# Altium schematic sheet ethernet.SchDoc
size 420 x 297 mm
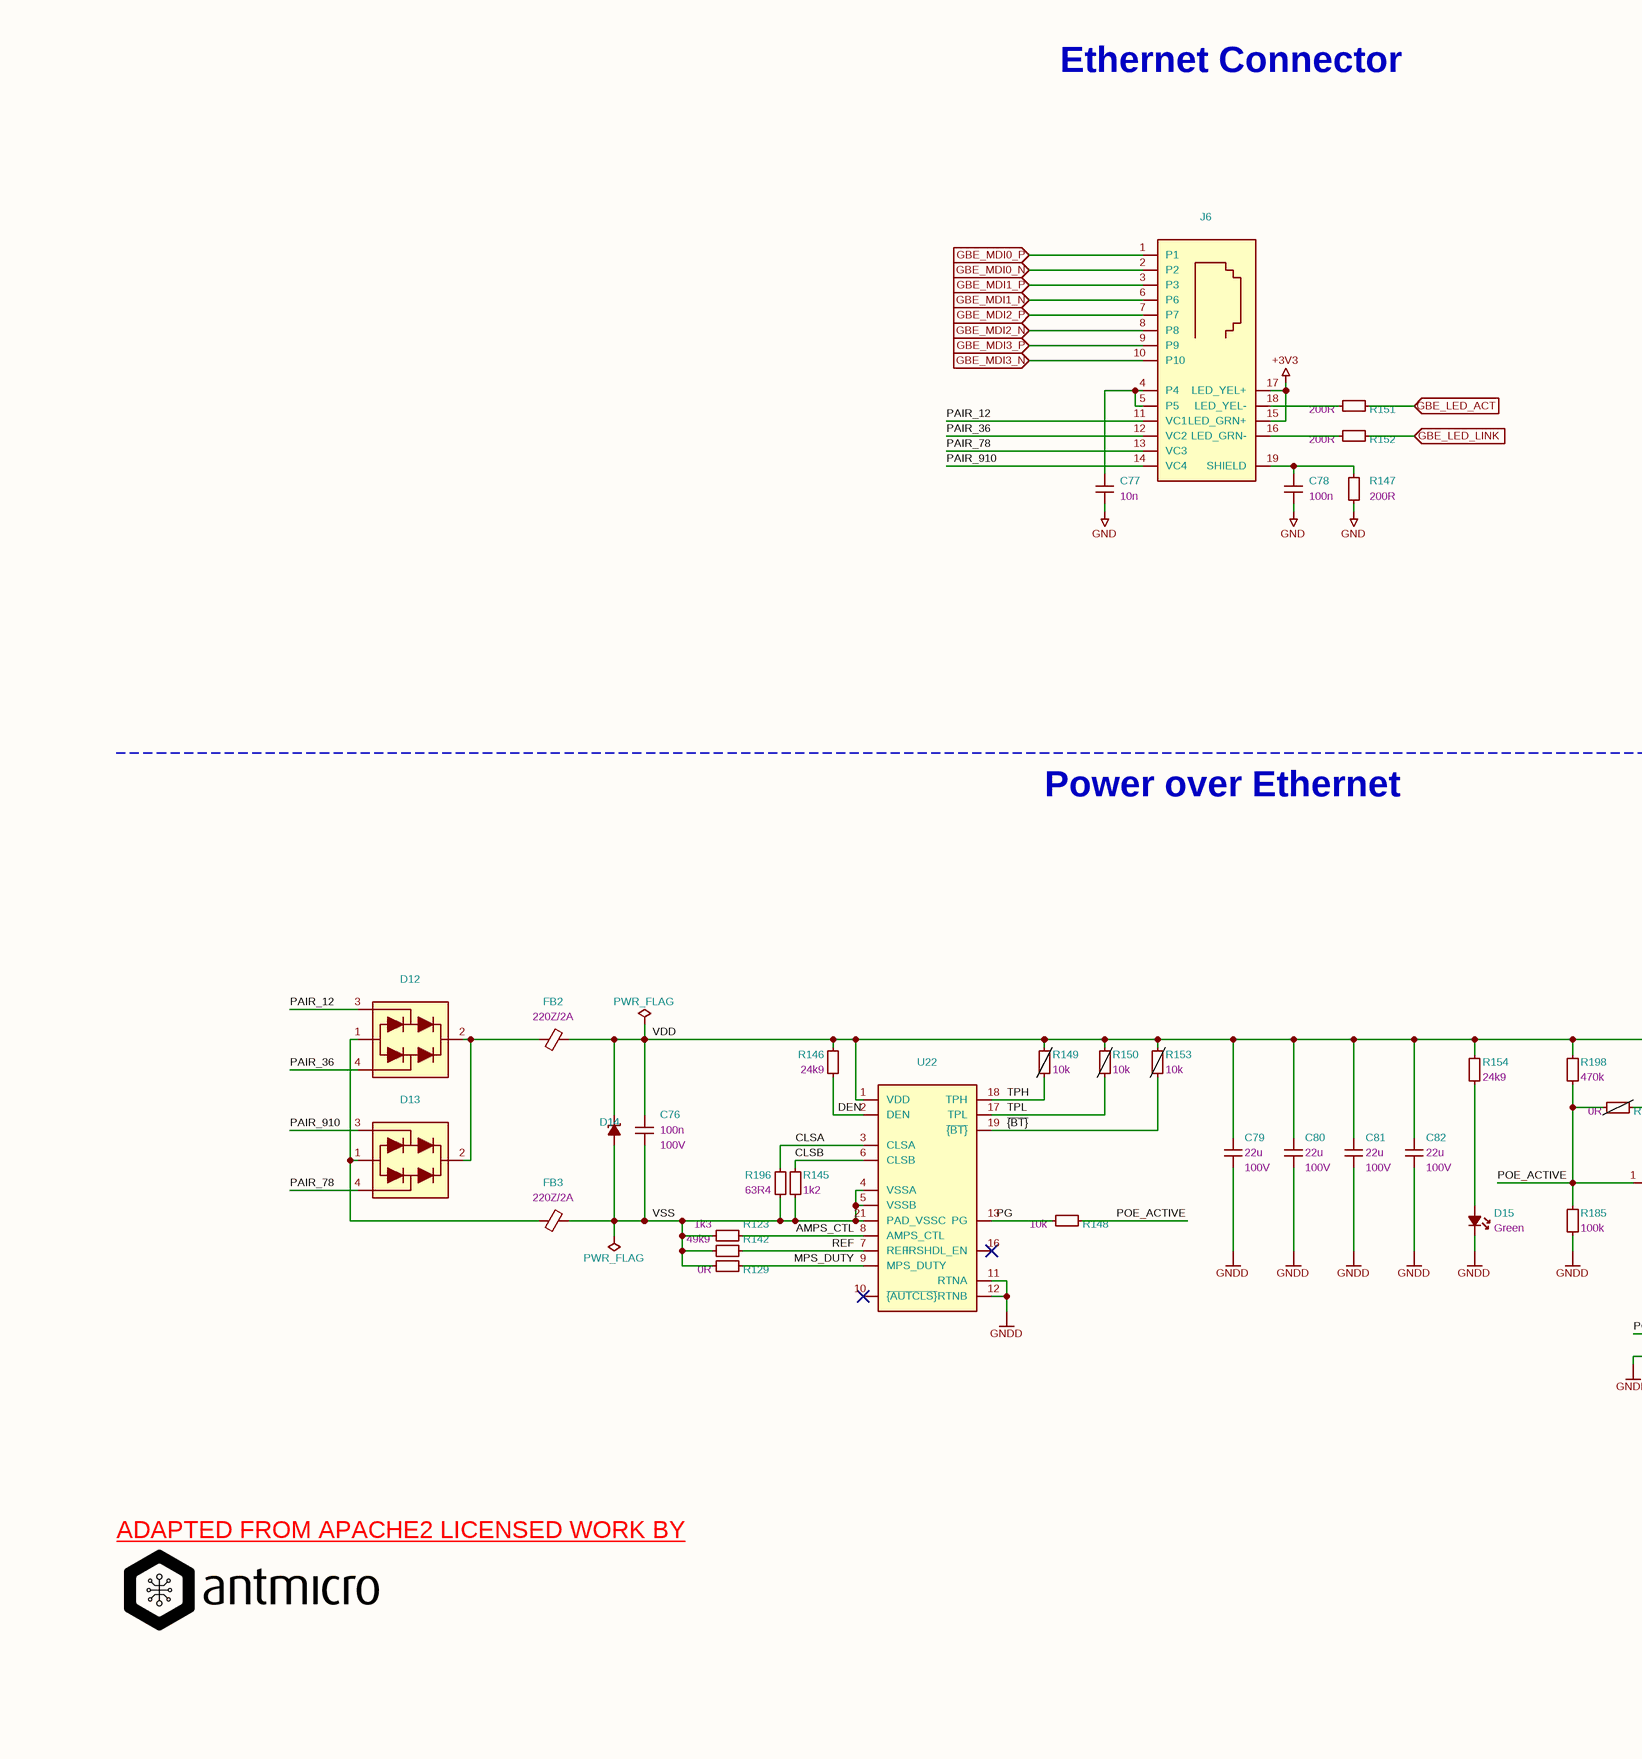
[diagram p0: ethernet.SchDoc, left]
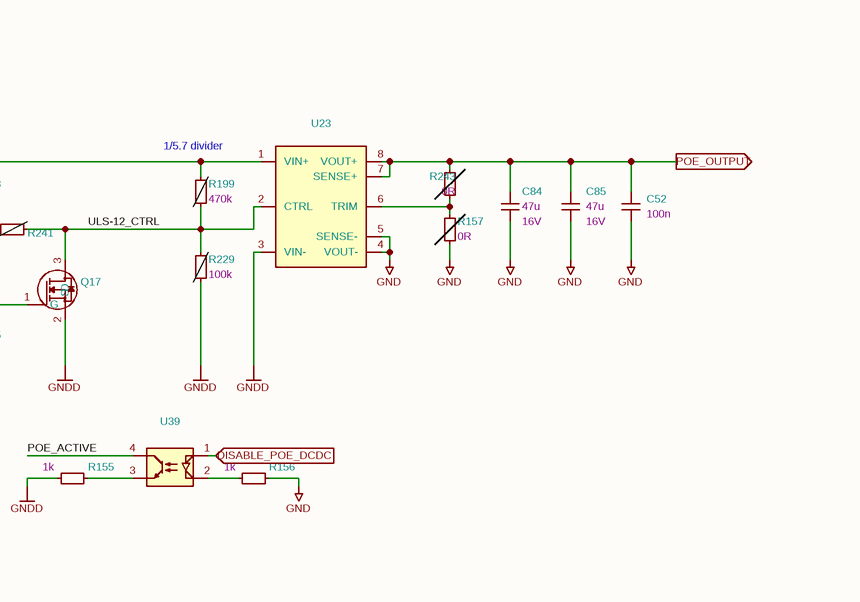
[diagram p1: ethernet.SchDoc, right]

## Parts
#FLG09  PWR_FLAG  (graphical)
#FLG010  PWR_FLAG  (graphical)
C52  Val: 100n  [C_0402_1005Metric]  (hidden comment: GRM155R61H104KE14D)
C76  Val: 100n  Voltage: 100V  [C_0805_2012Metric]  (hidden comment: CL21B104KCFNNNE)
C77  Val: 10n  [C_0603_1608Metric]  (hidden comment: 06031C103JAT2A)
C78  Val: 100n  [C_0402_1005Metric]  (hidden comment: GRM155R61H104KE14D)
C79  Val: 22u  Voltage: 100V  [C_2220_5650Metric]  (hidden comment: C5750X7S2A226M280KB)
C80  Val: 22u  Voltage: 100V  [C_2220_5650Metric]  (hidden comment: C5750X7S2A226M280KB)
C81  Val: 22u  Voltage: 100V  [C_2220_5650Metric]  (hidden comment: C5750X7S2A226M280KB)
C82  Val: 22u  Voltage: 100V  [C_2220_5650Metric]  (hidden comment: C5750X7S2A226M280KB)
C84  Val: 47u  Voltage: 16V  [C_1206_3216Metric]  (hidden comment: C3216X5R1C476M160AB)
C85  Val: 47u  Voltage: 16V  [C_1206_3216Metric]  (hidden comment: C3216X5R1C476M160AB)
D12  CD-MMBL110S  [DFN3538]  (value not drawn)
D13  CD-MMBL110S  [DFN3538]  (value not drawn)
D14  PTVS58VS1UR,115  [D_SOD-123F]  (value not drawn)
D15  Color: Green  [LED_0603_1608Metric_G]  (hidden comment: LTST-C190GKT)
FB2  Val: 220Z/2A  [FB_0805_2012Metric]  (hidden comment: BLM21PG221SN1D)
FB3  Val: 220Z/2A  [FB_0805_2012Metric]  (hidden comment: BLM21PG221SN1D)
J6  5-2337992-8  [RJ45_X-2337992-8_Horizontal]  (value not drawn)
Q17  PJE138K_R1_00001  [SOT-523]  (value not drawn)
R123  Val: 1k3  [R_0402_1005Metric]  (hidden comment: CR0402-FX-1301GLF)
R129  Val: 0R  [R_0402_1005Metric]  (hidden comment: ERJ2GE0R00X)
R142  Val: 49k9  [R_0402_1005Metric]  (hidden comment: CR0402-FX-4992GLF)
R145  Val: 1k2  [R_0402_1005Metric]  (hidden comment: CR0402-FX-1201GLF)
R146  Val: 24k9  [R_0402_1005Metric]  (hidden comment: CR0402-FX-2492GLF)
R147  Val: 200R  [R_0402_1005Metric]  (hidden comment: CR0402-FX-2000GLF)
R148  Val: 10k  [R_0402_1005Metric]  (hidden comment: CR0402-FX-1002GLF)
R149  Val: 10k  [R_0402_1005Metric]  (hidden comment: CR0402-FX-1002GLF)  (no BOM)
R150  Val: 10k  [R_0402_1005Metric]  (hidden comment: CR0402-FX-1002GLF)  (no BOM)
R151  Val: 200R  [R_0402_1005Metric]  (hidden comment: CR0402-FX-2000GLF)
R152  Val: 200R  [R_0402_1005Metric]  (hidden comment: CR0402-FX-2000GLF)
R153  Val: 10k  [R_0402_1005Metric]  (hidden comment: CR0402-FX-1002GLF)  (no BOM)
R154  Val: 24k9  [R_0402_1005Metric]  (hidden comment: CR0402-FX-2492GLF)
R155  Val: 1k  [R_0402_1005Metric]  (hidden comment: CR0402-FX-1001GLF)
R156  Val: 1k  [R_0402_1005Metric]  (hidden comment: CR0402-FX-1001GLF)
R157  Val: 0R  [R_0603_1608Metric]  (hidden comment: CR0603-J/-000ELF)  (no BOM)
R185  Val: 100k  [R_0402_1005Metric]  (hidden comment: CR0402-FX-1003GLF)
R196  Val: 63R4  [R_0603_1608Metric]  (hidden comment: CR0603-FX-63R4ELF)
R198  Val: 470k  [R_0402_1005Metric]  (hidden comment: CR0402-FX-4703GLF)
R199  Val: 470k  [R_0402_1005Metric]  (hidden comment: CR0402-FX-4703GLF)  (no BOM)
R229  Val: 100k  [R_0402_1005Metric]  (hidden comment: CR0402-FX-1003GLF)  (no BOM)
R241  Val: 0R  [R_0402_1005Metric]  (hidden comment: ERJ2GE0R00X)  (no BOM)
R243  Val: 0R  [R_0603_1608Metric]  (hidden comment: CR0603-J/-000ELF)  (no BOM)
U22  TPS2372-3RGWR  [VQFN-20_5x5x1mm_P0.65mm]  (value not drawn)
U23  ULS-12/5-D48N-C  [Conv_Murata_ULS-60W]  (value not drawn)
U39  ACPL-217-500E  [SOIC-4_4.55x2.6mm_P1.27mm]  (value not drawn)

## Ports
DISABLE_POE_DCDC (in), GBE_LED_ACT (in), GBE_LED_LINK (in), GBE_MDI0_N (in), GBE_MDI0_P (in), GBE_MDI1_N (in), GBE_MDI1_P (in), GBE_MDI2_N (in), GBE_MDI2_P (in), GBE_MDI3_N (in), GBE_MDI3_P (in), POE_OUTPUT (out)

## Nets
+3V3: J6.15(LED_GRN+) J6.17(LED_YEL+)
GND: C52.2 C77.1 C78.2 C84.1 C85.1 R147.1 R156.2 R157.1 U23.4(VOUT-) U23.5(SENSE-)
GNDD: C79.1 C80.1 C81.1 C82.1 D15.1(C) Q17.2(S) R155.1 R185.1 R229.1 U22.11(RTNA) U22.12(RTNB) U23.3(VIN-)
AMPS_CTL: R123.2 U22.8(AMPS_CTL)
CLSA: R196.2 U22.3(CLSA)
CLSB: R145.2 U22.6(CLSB)
DEN: R146.1 U22.2(DEN)
DISABLE_POE_DCDC: U39.1 ; port DISABLE_POE_DCDC
GBE_LED_ACT: R151.2 ; port GBE_LED_ACT
GBE_LED_LINK: R152.2 ; port GBE_LED_LINK
GBE_MDI0_N: J6.2(P2) ; port GBE_MDI0_N
GBE_MDI0_P: J6.1(P1) ; port GBE_MDI0_P
GBE_MDI1_N: J6.6(P6) ; port GBE_MDI1_N
GBE_MDI1_P: J6.3(P3) ; port GBE_MDI1_P
GBE_MDI2_N: J6.8(P8) ; port GBE_MDI2_N
GBE_MDI2_P: J6.7(P7) ; port GBE_MDI2_P
GBE_MDI3_N: J6.10(P10) ; port GBE_MDI3_N
GBE_MDI3_P: J6.9(P9) ; port GBE_MDI3_P
MPS_DUTY: R129.1 U22.9(MPS_DUTY)
PAIR_12: D12.3 J6.11(VC1)
PAIR_36: D12.4 J6.12(VC2)
PAIR_78: D13.4 J6.13(VC3)
PAIR_910: D13.3 J6.14(VC4)
PG: R148.2 U22.13(PG)
POE_ACTIVE: Q17.1(G) R148.1 R185.2 R198.1 R241.2 U39.4
POE_OUTPUT: C52.1 C84.2 C85.2 R243.1 U23.7(SENSE+) U23.8(VOUT+) ; port POE_OUTPUT
REF: R142.2 U22.7(REF)
TPH: R149.1 U22.18(TPH)
TPL: R150.1 U22.17(TPL)
ULS-12_CTRL: Q17.3(D) R199.1 R229.2 R241.1 U23.2(CTRL)
VDD: #FLG09.1(pwr) C76.2 C79.2 C80.2 C81.2 C82.2 D14.1(C) FB2.2 R146.2 R149.2 R150.2 R153.2 R154.2 R198.2 R199.2 U22.1(VDD) U23.1(VIN+)
VSS: #FLG010.1(pwr) C76.1 D14.2(A) FB3.2 R123.1 R129.2 R142.1 R145.1 R196.1 U22.4(VSSA) U22.5(VSSB) U22.21(PAD_VSSC)
~{{BT}}: R153.1 U22.19(~{{BT}})
NetC77_2: C77.2 J6.4(P4) J6.5(P5)
NetC78_1: C78.1 J6.19(SHIELD) R147.2
NetD12_1: D12.1 D13.1 FB3.1
NetD12_2: D12.2 D13.2 FB2.1
NetD15_2: D15.2(A) R154.1
NetJ6_16: J6.16(LED_GRN-) R152.1
NetJ6_18: J6.18(LED_YEL-) R151.1
NetR155_2: R155.2 U39.3
NetR156_1: R156.1 U39.2
NetR157_2: R157.2 R243.2 U23.6(TRIM)

Not connected (* = marked no-connect by the designer): J6 20(SHIELD); U22 10(~{{AUTCLS}})* 14(NC) 15(NC) 16(IRSHDL_EN)* 20(NC)

## Notes on the sheet
- Ethernet Connector
- Power over Ethernet
- 1/5.7 divider
- ADAPTED FROM APACHE2 LICENSED WORK BY <https://github.com/antmicro/jetson-orin-baseboard>
- 1
- 2
- 3
- 4
- 5
- 6
- 7
- 8
- A
- B
- C
- D
- E
- www.antmicro.com <http://www.antmicro.com>
- Title: Jetson Orin Baseboard
- File: ethernet.kicad_sch
- Sheet: /
- Antmicro Ltd
- F
- KiCad E.D.A.  kicad (5.1.4)-1
- Size: A3
- Date: 2025-01-15
- Rev: 1.3.0
- Id: 1/1

## Library data of the parts
C52 C78 = C_100n_0402: Manufacturer 1: Murata; License: Apache-2.0; Voltage: 50V; Dielectric: X5R; Author: Antmicro; OldValue: C_100n_0402; Manufacturer Part Number 1: GRM155R61H104KE14D; Value: GRM155R61H104KE14D; Footprint: antmicro-footprints:C_0402_1005Metric
C76 = C_100n_100V_0805: Manufacturer 1: Samsung Electro-Mechanics; License: Apache-2.0; Dielectric: X7R; Public: False; Author: Antmicro; OldValue: C_100n_100V_0805; Manufacturer Part Number 1: CL21B104KCFNNNE; Value: CL21B104KCFNNNE; Footprint: antmicro-footprints:C_0805_2012Metric
C77 = C_10n_0603: Manufacturer 1: AVX; License: Apache-2.0; Author: Antmicro; OldValue: C_10n_0603; Manufacturer Part Number 1: 06031C103JAT2A; Value: 06031C103JAT2A; Footprint: antmicro-footprints:C_0603_1608Metric
C79-C82 = C_22u_100V_2220: Manufacturer 1: TDK; License: Apache-2.0; Dielectric: X7S; Public: False; Author: Antmicro; OldValue: C_22u_100V_2220; Manufacturer Part Number 1: C5750X7S2A226M280KB; Value: C5750X7S2A226M280KB; Footprint: antmicro-footprints:C_2220_5650Metric
C84 C85 = C_47u_16V_1206: Manufacturer 1: TDK; License: Apache-2.0; Dielectric: X5R; Public: False; Author: Antmicro; OldValue: C_47u_16V_1206; Manufacturer Part Number 1: C3216X5R1C476M160AB; Value: C3216X5R1C476M160AB; Footprint: antmicro-footprints:C_1206_3216Metric
D12 D13 = CD-MMBL110S: Manufacturer 1: Bourns; License: Apache-2.0; Author: Antmicro; OldValue: CD-MMBL110S; Manufacturer Part Number 1: CD-MMBL110S; Value: CD-MMBL110S; Footprint: antmicro-footprints:DFN3538
D14 = PTVS58VS1UR,115: Manufacturer 1: Nexperia; License: Apache-2.0; Author: Antmicro; OldValue: PTVS58VS1UR,115; Manufacturer Part Number 1: PTVS58VS1UR,115; Value: PTVS58VS1UR,115; Footprint: antmicro-footprints:D_SOD-123F
D15 = LED_G_0603_LTST-C190GKT: Manufacturer 1: Lite-On; License: Apache-2.0; Author: Antmicro; OldValue: LED_G_0603_LTST-C190GKT; Manufacturer Part Number 1: LTST-C190GKT; Value: LTST-C190GKT; Footprint: antmicro-footprints:LED_0603_1608Metric_G
FB2 FB3 = FB_220Z_2A_Murata-BLM21PG_0805: Manufacturer 1: Murata; License: Apache-2.0; Author: Antmicro; OldValue: FB_220Z_2A_Murata-BLM21PG_0805; Manufacturer Part Number 1: BLM21PG221SN1D; Value: BLM21PG221SN1D; Footprint: antmicro-footprints:FB_0805_2012Metric
J6 = Bus_RJ45_5-2337992-8: Manufacturer 1: TE Connectivity; License: Apache-2.0; Author: Antmicro; OldValue: Bus_RJ45_5-2337992-8; Manufacturer Part Number 1: 5-2337992-8; Value: 5-2337992-8; Footprint: antmicro-footprints:RJ45_X-2337992-8_Horizontal
Q17 = PJE138K: Manufacturer 1: PANJIT; License: Apache-2.0; Author: Antmicro; OldValue: PJE138K; Manufacturer Part Number 1: PJE138K_R1_00001; Value: PJE138K_R1_00001; Footprint: antmicro-footprints:SOT-523
R123 = R_1k3_0402: Manufacturer 1: Bourns; License: Apache-2.0; Tolerance: 1%; Author: Antmicro; OldValue: R_1k3_0402; Manufacturer Part Number 1: CR0402-FX-1301GLF; Value: CR0402-FX-1301GLF; Footprint: antmicro-footprints:R_0402_1005Metric
R129 R241 = R_0R_0402: Manufacturer 1: Panasonic; License: Apache-2.0; Tolerance: ~; Current: 1A; Author: Antmicro; OldValue: R_0R_0402; Manufacturer Part Number 1: ERJ2GE0R00X; Value: ERJ2GE0R00X; Footprint: antmicro-footprints:R_0402_1005Metric
R142 = R_49k9_0402: Manufacturer 1: Bourns; License: Apache-2.0; Tolerance: 1%; Author: Antmicro; OldValue: R_49k9_0402; Manufacturer Part Number 1: CR0402-FX-4992GLF; Value: CR0402-FX-4992GLF; Footprint: antmicro-footprints:R_0402_1005Metric
R145 = R_1k2_0402: Manufacturer 1: Bourns; License: Apache-2.0; Tolerance: 1%; Author: Antmicro; OldValue: R_1k2_0402; Manufacturer Part Number 1: CR0402-FX-1201GLF; Value: CR0402-FX-1201GLF; Footprint: antmicro-footprints:R_0402_1005Metric
R146 R154 = R_24k9_0402: Manufacturer 1: Bourns; License: Apache-2.0; Tolerance: 1%; Author: Antmicro; OldValue: R_24k9_0402; Manufacturer Part Number 1: CR0402-FX-2492GLF; Value: CR0402-FX-2492GLF; Footprint: antmicro-footprints:R_0402_1005Metric
R147 R151 R152 = R_200R_0402: Manufacturer 1: Bourns; License: Apache-2.0; Tolerance: 1%; Author: Antmicro; OldValue: R_200R_0402; Manufacturer Part Number 1: CR0402-FX-2000GLF; Value: CR0402-FX-2000GLF; Footprint: antmicro-footprints:R_0402_1005Metric
R148-R150 R153 = R_10k_0402: Manufacturer 1: Bourns; License: Apache-2.0; Tolerance: 1%; Author: Antmicro; OldValue: R_10k_0402; Manufacturer Part Number 1: CR0402-FX-1002GLF; Value: CR0402-FX-1002GLF; Footprint: antmicro-footprints:R_0402_1005Metric
R155 R156 = R_1k_0402: Manufacturer 1: Bourns; License: Apache-2.0; Tolerance: 1%; Author: Antmicro; OldValue: R_1k_0402; Manufacturer Part Number 1: CR0402-FX-1001GLF; Value: CR0402-FX-1001GLF; Footprint: antmicro-footprints:R_0402_1005Metric
R157 R243 = R_0R_0603: Manufacturer 1: Bourns; License: Apache-2.0; Tolerance: ~; Current: 1A; Author: Antmicro; OldValue: R_0R_0603; Manufacturer Part Number 1: CR0603-J/-000ELF; Value: CR0603-J/-000ELF; Footprint: antmicro-footprints:R_0603_1608Metric
R185 R229 = R_100k_0402: Manufacturer 1: Bourns; License: Apache-2.0; Tolerance: 1%; Author: Antmicro; OldValue: R_100k_0402; Manufacturer Part Number 1: CR0402-FX-1003GLF; Value: CR0402-FX-1003GLF; Footprint: antmicro-footprints:R_0402_1005Metric
R196 = R_63R4_0603: Manufacturer 1: Bourns; License: Apache-2.0; Tolerance: 1%; Author: Antmicro; OldValue: R_63R4_0603; Manufacturer Part Number 1: CR0603-FX-63R4ELF; Value: CR0603-FX-63R4ELF; Footprint: antmicro-footprints:R_0603_1608Metric
R198 R199 = R_470k_0402: Manufacturer 1: Bourns; License: Apache-2.0; Tolerance: 1%; Author: Antmicro; OldValue: R_470k_0402; Manufacturer Part Number 1: CR0402-FX-4703GLF; Value: CR0402-FX-4703GLF; Footprint: antmicro-footprints:R_0402_1005Metric
U22 = TPS2372-3RGWR: Manufacturer 1: Texas Instruments; License: Apache-2.0; Author: Antmicro; OldValue: TPS2372-3RGWR; Manufacturer Part Number 1: TPS2372-3RGWR; Value: TPS2372-3RGWR; Footprint: antmicro-footprints:VQFN-20_5x5x1mm_P0.65mm
U23 = ULS-12_5-D48N-C: Manufacturer 1: Murata; License: Apache-2.0; Alternatives 50W: VCB4812SBO-50WR3, V36SE12004NRFA, PKU5513ESI, KHHD004A2B41Z; Alternatives 75W: VCB4812SBO-75WR3; Alternatives 100W: PKU4913DPIHS, VCB4812SBO-100WFR3; Alternatives 120W: PQC50-48-S12-O; Author: Antmicro; OldValue: ULS-12_5-D48N-C; Manufacturer Part Number 1: ULS-12/5-D48N-C; Value: ULS-12/5-D48N-C; Footprint: antmicro-footprints:Conv_Murata_ULS-60W
U39 = ACPL-217-500E: Manufacturer 1: Broadcom; License: Apache-2.0; Author: Antmicro; OldValue: ACPL-217-500E; Manufacturer Part Number 1: ACPL-217-500E; Value: ACPL-217-500E; Footprint: antmicro-footprints:SOIC-4_4.55x2.6mm_P1.27mm
#FLG09 #FLG010 = PWR_FLAG: Value: PWR_FLAG